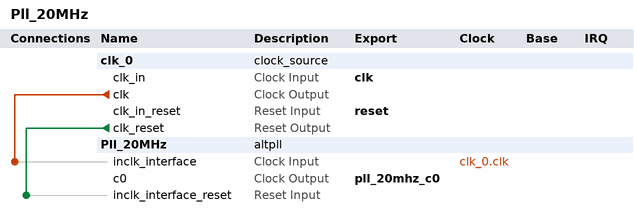
[diagram p0: system contents]
# Platform Designer (Qsys) system Pll_20MHz, MAX 10 10M50DAF484C7G
# Parameters at their usual value, and those the tool derives, are not listed.
package require -exact qsys 20.1
create_system Pll_20MHz
set_project_property DEVICE_FAMILY {MAX 10}
set_project_property DEVICE 10M50DAF484C7G

add_instance clk_0 clock_source 20.1
set_instance_parameter_value clk_0 clockFrequency 50000000

add_instance Pll_20MHz altpll 20.1
set_instance_parameter_value Pll_20MHz CLK0_DIVIDE_BY 5
set_instance_parameter_value Pll_20MHz CLK0_MULTIPLY_BY 2
set_instance_parameter_value Pll_20MHz INCLK0_INPUT_FREQUENCY 20000
set_instance_parameter_value Pll_20MHz PORT_ARESET PORT_UNUSED
set_instance_parameter_value Pll_20MHz PORT_LOCKED PORT_UNUSED
set_instance_parameter_value Pll_20MHz PORT_clk1 PORT_UNUSED
set_instance_parameter_value Pll_20MHz PORT_clk2 PORT_UNUSED
set_instance_parameter_value Pll_20MHz PORT_clk3 PORT_UNUSED

# connections
add_connection clk_0.clk Pll_20MHz.inclk_interface clock
add_connection clk_0.clk_reset Pll_20MHz.inclk_interface_reset reset

# exported interfaces
add_interface clk clock sink
set_interface_property clk EXPORT_OF clk_0.clk_in
add_interface pll_20mhz_c0 clock source
set_interface_property pll_20mhz_c0 EXPORT_OF Pll_20MHz.c0
add_interface reset reset sink
set_interface_property reset EXPORT_OF clk_0.clk_in_reset

set_interconnect_requirement {$system} qsys_mm.clockCrossingAdapter HANDSHAKE
set_interconnect_requirement {$system} qsys_mm.enableEccProtection FALSE
set_interconnect_requirement {$system} qsys_mm.insertDefaultSlave FALSE
set_interconnect_requirement {$system} qsys_mm.maxAdditionalLatency 1

save_system Pll_20MHz.qsys
